# EAGLE design Craft (EAGLE 6.6.0)
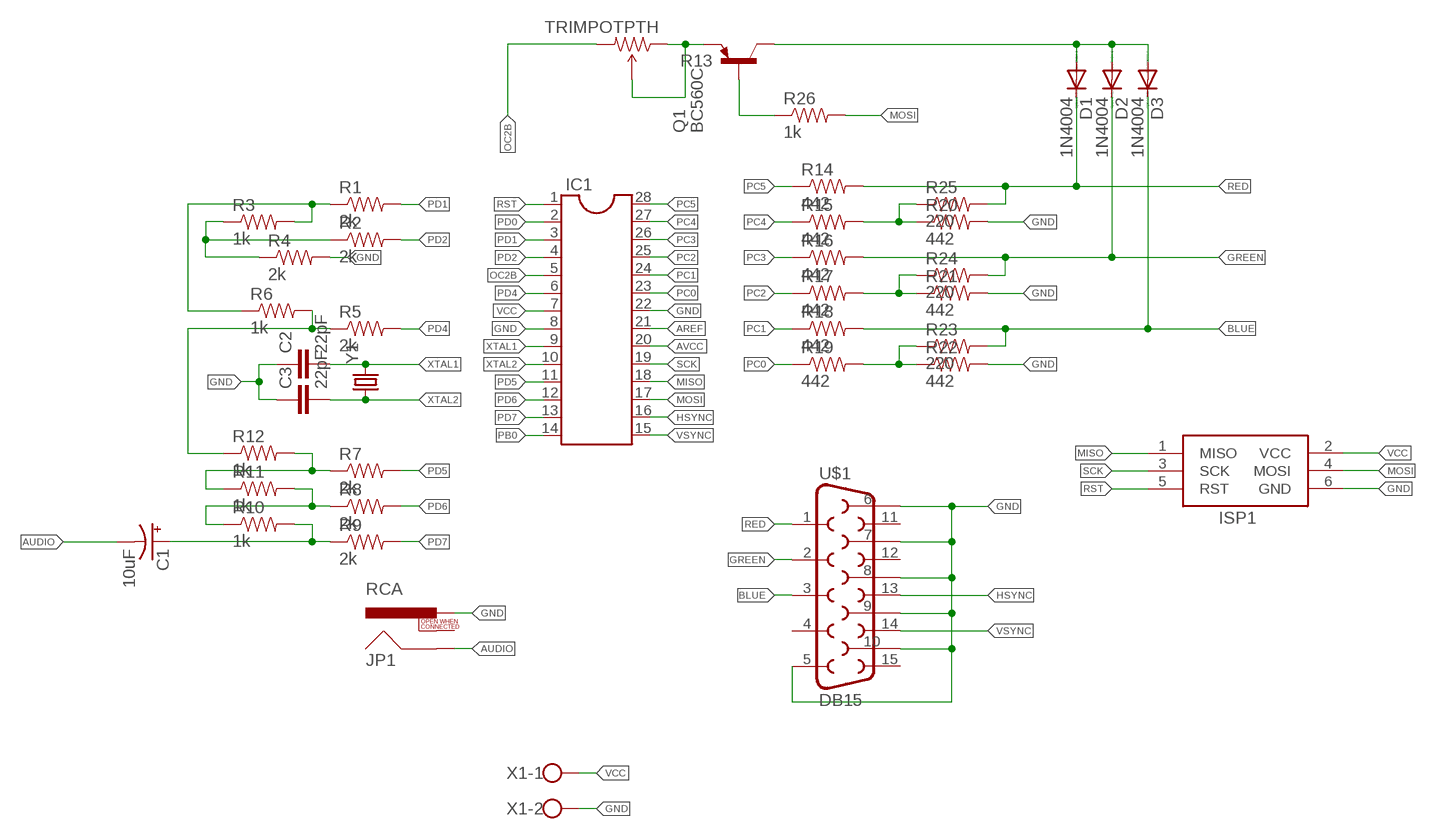
[diagram p0: schematic, sheet 1]

## Parts
C1  10uF  CAP_POLPTH1  [CPOL-RADIAL-100UF-25V]
C2  22pF  CAPEZ  [CAP-PTH-SMALLEZ]
C3  22pF  CAPEZ  [CAP-PTH-SMALLEZ]
D1  1N4004  [DO41-10]
D2  1N4004  [DO41-10]
D3  1N4004  [DO41-10]
IC1  DIL28-3  [DIL28-3]
ISP1  AVRISP-6  [AVRISP]
JP1  RCA  [RCA]
Q1  BC560C  [TO92-EBC]
R1  2k  RESISTORPTH-1/4W  [AXIAL-0.4]
R2  2k  RESISTORPTH-1/4W  [AXIAL-0.4]
R3  1k  RESISTORPTH-1/4W  [AXIAL-0.4]
R4  2k  RESISTORPTH-1/4W  [AXIAL-0.4]
R5  2k  RESISTORPTH-1/4W  [AXIAL-0.4]
R6  1k  RESISTORPTH-1/4W  [AXIAL-0.4]
R7  2k  RESISTORPTH-1/4W  [AXIAL-0.4]
R8  2k  RESISTORPTH-1/4W  [AXIAL-0.4]
R9  2k  RESISTORPTH-1/4W  [AXIAL-0.4]
R10  1k  RESISTORPTH-1/4W  [AXIAL-0.4]
R11  1k  RESISTORPTH-1/4W  [AXIAL-0.4]
R12  1k  RESISTORPTH-1/4W  [AXIAL-0.4]
R13  TRIMPOTPTH  [TRIM_POT_PTH]
R14  442  RESISTORPTH-1/4W  [AXIAL-0.4]
R15  442  RESISTORPTH-1/4W  [AXIAL-0.4]
R16  442  RESISTORPTH-1/4W  [AXIAL-0.4]
R17  442  RESISTORPTH-1/4W  [AXIAL-0.4]
R18  442  RESISTORPTH-1/4W  [AXIAL-0.4]
R19  442  RESISTORPTH-1/4W  [AXIAL-0.4]
R20  442  RESISTORPTH-1/4W  [AXIAL-0.4]
R21  442  RESISTORPTH-1/4W  [AXIAL-0.4]
R22  442  RESISTORPTH-1/4W  [AXIAL-0.4]
R23  220  RESISTORPTH-1/4W  [AXIAL-0.4]
R24  220  RESISTORPTH-1/4W  [AXIAL-0.4]
R25  220  RESISTORPTH-1/4W  [AXIAL-0.4]
R26  1k  RESISTORPTH-1/4W  [AXIAL-0.4]
U$1  DB15  [DB15]
X1  W237-102  [W237-102]
Y1  CRYSTALHC49UV  [HC49U-V]

## Nets
AREF: IC1.21
AUDIO: C1.2(-) JP1.SHELL
AVCC: IC1.20
BLUE: D3.C R18.P$2 R23.P$2 U$1.3
GND: C2.1 C3.1 IC1.8 IC1.22 ISP1.6(GND) JP1.PIN R4.P$2 R20.P$2 R21.P$2 R22.P$2 U$1.5 U$1.6 U$1.7 U$1.8 U$1.9 U$1.10 X1.2
GREEN: D2.C R16.P$2 R24.P$2 U$1.2
HSYNC: IC1.16 U$1.13
MISO: IC1.18 ISP1.1(MISO)
MOSI: IC1.17 ISP1.4(MOSI) R26.P$2
N$1: Q1.E R13.1(CCW) R13.2(WIPER)
N$2: D1.A D2.A D3.A Q1.C
N$3: Q1.B R26.P$1
N$4: R1.P$1 R3.P$2 R6.P$1
N$5: R5.P$1 R6.P$2 R12.P$1
N$6: R2.P$1 R3.P$1 R4.P$1
N$10: C1.1(+) R9.P$1 R10.P$2
N$11: R8.P$1 R10.P$1 R11.P$2
N$13: R7.P$1 R11.P$1 R12.P$2
N$16: R15.P$2 R20.P$1 R25.P$1
N$17: R17.P$2 R21.P$1 R24.P$1
N$18: R19.P$2 R22.P$1 R23.P$1
OC2B: IC1.5 R13.3(CW)
PB0: IC1.14
PC0: IC1.23 R19.P$1
PC1: IC1.24 R18.P$1
PC2: IC1.25 R17.P$1
PC3: IC1.26 R16.P$1
PC4: IC1.27 R15.P$1
PC5: IC1.28 R14.P$1
PD0: IC1.2
PD1: IC1.3 R1.P$2
PD2: IC1.4 R2.P$2
PD4: IC1.6 R5.P$2
PD5: IC1.11 R7.P$2
PD6: IC1.12 R8.P$2
PD7: IC1.13 R9.P$2
RED: D1.C R14.P$2 R25.P$2 U$1.1
RST: IC1.1 ISP1.5(RST)
SCK: IC1.19 ISP1.3(SCK)
VCC: IC1.7 ISP1.2(VCC) X1.1
VSYNC: IC1.15 U$1.14
XTAL1: C2.2 IC1.9 Y1.2
XTAL2: C3.2 IC1.10 Y1.1
Unconnected: JP1.SWITCH U$1.4 U$1.11 U$1.12 U$1.15

## Library data of the parts
C1 = SparkFun-Capacitors:CAP_POL: Capacitor Polarized These are standard SMD and PTH capacitors. Normally 10uF, 47uF, and 100uF in electrolytic and tantalum varieties. Always verify the external diameter of the through hole cap, it varies with capacity, voltage, and manufacturer. The EIA devices should be standard.
C2 C3 = SparkFun-Capacitors:CAP: Capacitor Standard 0603 ceramic capacitor, and 0.1" leaded capacitor.
D1-D3 = diode:1N4004: DIODE general purpose rectifier, 1 A
IC1 = ic-package:DIL28: Dual In Line
ISP1 = adafruit:AVRISP: AVR ISP HEADER Standard 6 pin header for AVR programming
JP1 = SparkFun-Connectors:RCA
Q1 = transistor-pnp:BC560*: PNP Transistror
R1-R12 R14-R26 = SparkFun-Resistors:RESISTOR: Resistor Basic schematic elements and footprints for 0603, 1206, and PTH resistors.
R13 = SparkFun-Electromechanical:TRIMPOT: Various small potentiometers for "set-and-forget" applications
U$1 = SparkFun-Connectors:DB15: DB15 / VGA right angle through-hole female connector.
X1 = con-wago-500:W237-102: WAGO SCREW CLAMP; MPN: 237-102; OC_FARNELL: unknown; OC_NEWARK: 70K9898
Y1 = SparkFun-FreqCtrl:CRYSTAL: Various standard crystals. Proven footprints. Spark Fun Electronics SKU : COM-00534

## Board
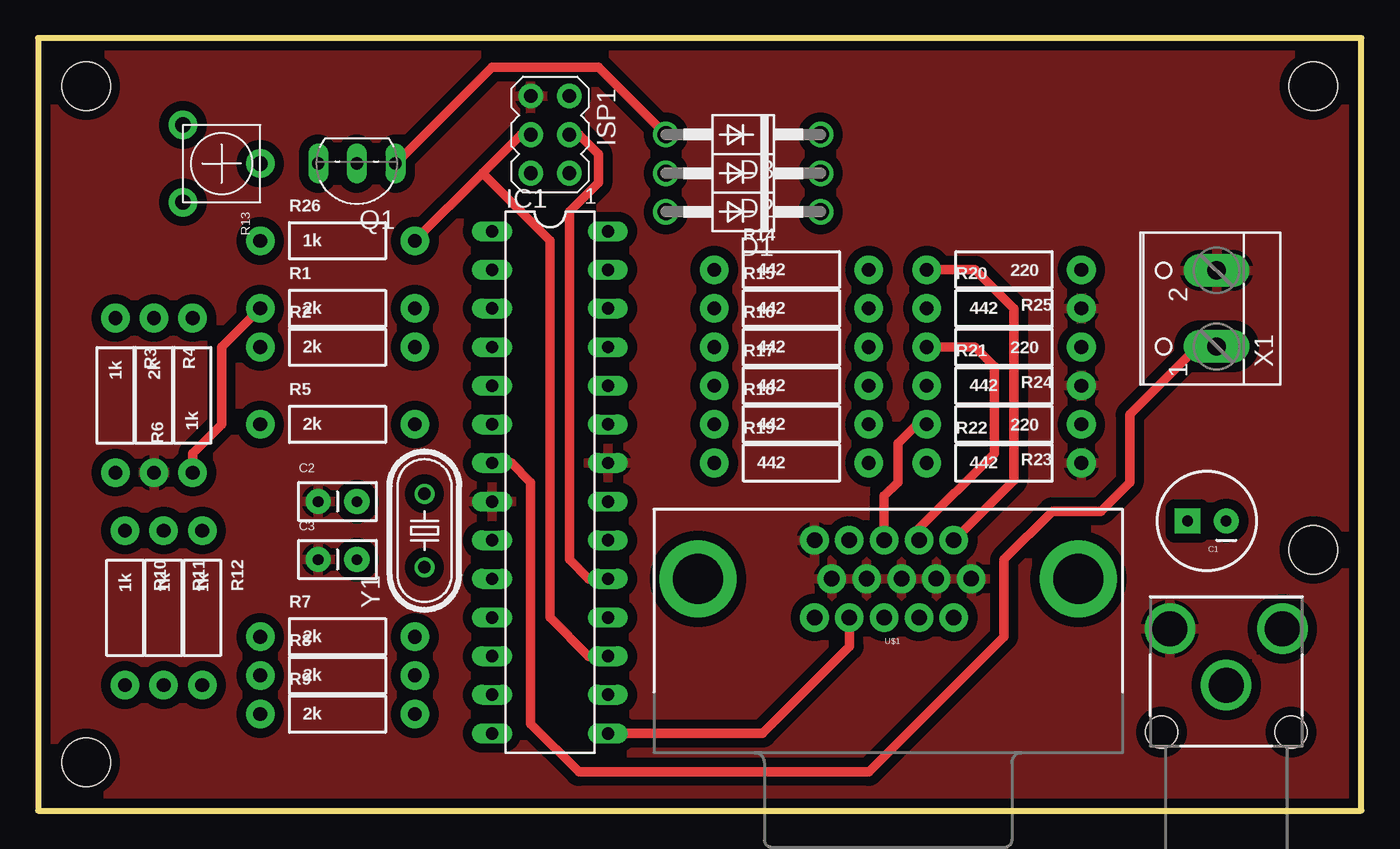
[diagram p1: board, top side]
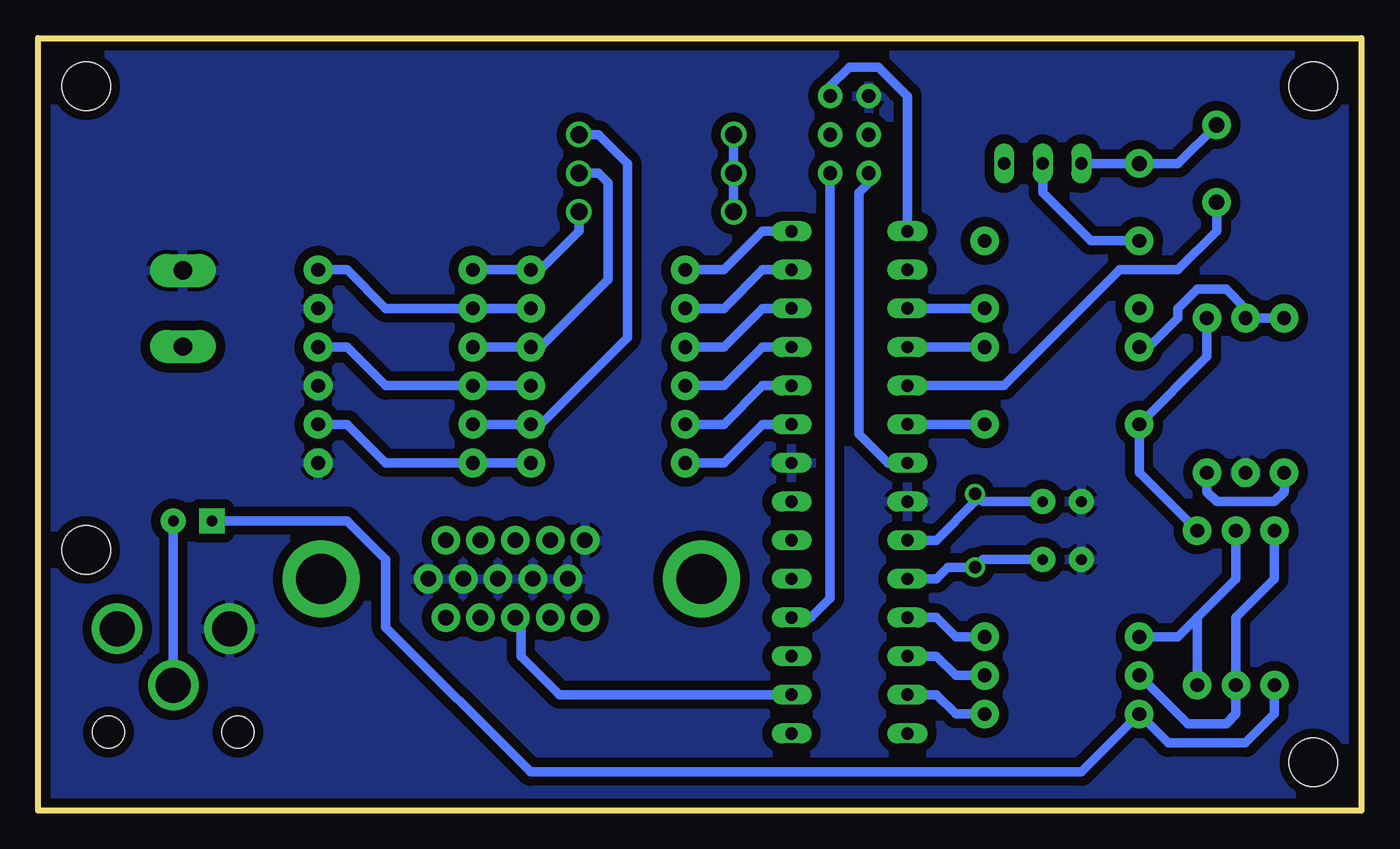
[diagram p2: board, bottom side, seen from below]

Size 87 x 50.8 mm. Coordinates in mm from the lower left corner, seen from the top.
Outline: 0,0 87,0 87,50.8 0,50.8 0,0
Copper layers (1*16): Top 0.035mm / dielectric 1.5mm / Bottom 0.035mm
Design rules "default *": minimum track width 10mil, minimum drill 24mil, track to track 8mil, track to pad 8mil, pad to pad 8mil, via to via 8mil, smd to smd 8mil, copper to edge 10mil, drill to drill 8mil, minimum pad ring 10mil, minimum via ring 8mil, stop-mask expansion 4mil, vias tented up to drill 0mil, thermal gap 10mil
Holes 3.2 mm at 3.17,47.62 3.17,3.17 83.82,47.62 83.82,17.14

### Footprints (pad centres in the part's own frame; a part is rotated, then mirrored left to right if it is on the bottom)
CPOL-RADIAL-100UF-25V = drill 0.7 pad 1.651 square: 1 1.27,0 | drill 0.7 pad 1.651: 2 -1.27,0
CAP-PTH-SMALLEZ = drill 0.7 pad 1.651: 1 0,0; 2 2.54,0
DO41-10 = drill 1.118: A 5.08,0; C -5.08,0
DIL28-3 = drill 0.813 long: 1 -16.51,-3.81; 2 -13.97,-3.81; 3 -11.43,-3.81; 4 -8.89,-3.81; 5 -6.35,-3.81; 6 -3.81,-3.81; 7 -1.27,-3.81; 8 1.27,-3.81; 9 3.81,-3.81; 10 6.35,-3.81; 11 8.89,-3.81; 12 11.43,-3.81; 13 13.97,-3.81; 14 16.51,-3.81; 15 16.51,3.81; 16 13.97,3.81; 17 11.43,3.81; 18 8.89,3.81; 19 6.35,3.81; 20 3.81,3.81; 21 1.27,3.81; 22 -1.27,3.81; 23 -3.81,3.81; 24 -6.35,3.81; 25 -8.89,3.81; 26 -11.43,3.81; 27 -13.97,3.81; 28 -16.51,3.81
AVRISP = drill 0.9 pad 1.626: 1 -1.27,2.54; 2 1.27,2.54; 3 -1.27,0; 4 1.27,0; 5 -1.27,-2.54; 6 1.27,-2.54
RCA = drill 2.3: PIN 3.7,3.7; SHELL 0,0; SWITCH 3.7,-3.7 | hole 2.1: -3.1,4.25; -3.1,-4.25
TO92-EBC = drill 0.813 long: B 0,-1.27; C -2.54,-1.27; E 2.54,-1.27
AXIAL-0.4 = drill 0.9 pad 1.88: P$1 -5.08,0; P$2 5.08,0
TRIM_POT_PTH = drill 1 pad 1.88: 1 -2.54,-2.54; 2 0,2.54; 3 2.54,-2.54
DB15 = drill 1.016 pad 1.88: 1 -4.32,-7.62; 2 -2.03,-7.62; 3 0.26,-7.62; 4 2.55,-7.62; 5 4.84,-7.62; 6 -5.46,-5.08; 7 -3.17,-5.08; 8 -0.88,-5.08; 9 1.41,-5.08; 10 3.7,-5.08; 11 -4.32,-2.54; 12 -2.03,-2.54; 13 0.26,-2.54; 14 2.55,-2.54; 15 4.84,-2.54 | drill 3.302 pad 5.08: G1 -12.5,-5.08; G2 12.5,-5.08
W237-102 = drill 1.194 pad 2.184 long: 1 -2.5,-1.27; 2 2.5,-1.27
HC49U-V = drill 0.813: 1 -2.413,0; 2 2.413,0

### Placement (x,y rotation side)
C1  76.83,19.05 180 top
C2  18.41,20.32 0 top
C3  18.41,16.51 0 top
D1  46.35,39.37 180 top
D2  46.35,41.91 180 top
D3  46.35,44.45 180 top
IC1  33.66,21.59 270 top
ISP1  33.66,44.45 180 top
JP1  78.11,8.26 90 top
Q1  20.95,41.27 180 top
R1  19.68,33.02 0 top
R2  19.68,30.48 0 top
R3  5.08,27.3 270 top
R4  7.62,27.3 270 top
R5  19.68,25.4 0 top
R6  10.16,27.3 90 top
R7  19.68,11.43 0 top
R8  19.68,8.89 0 top
R9  19.68,6.35 0 top
R10  5.71,13.34 270 top
R11  8.26,13.34 270 top
R12  10.79,13.34 270 top
R13  12.06,42.55 270 top
R14  49.53,35.56 0 top
R15  49.53,33.02 0 top
R16  49.53,30.48 0 top
R17  49.53,27.94 0 top
R18  49.53,25.4 0 top
R19  49.53,22.86 0 top
R20  63.5,33.02 0 top
R21  63.5,27.94 0 top
R22  63.5,22.86 0 top
R23  63.5,25.4 180 top
R24  63.5,30.48 180 top
R25  63.5,35.56 180 top
R26  19.68,37.47 0 top
U$1  55.88,10.16 180 top
X1  76.2,33.02 90 top
Y1  25.4,18.41 90 top

### Tracks (layer width: path | path; a pad name or v marks a point on that pad's centre or on a via)
AUDIO
  Bottom 0.61: C1.2 JP1.SHELL
BLUE
  Top 0.61: U$1.3 55.62,20.7 56.52,21.59 56.52,24.13 57.78,25.4 R23.P$2
  Bottom 0.61: R23.P$2 R18.P$2 53.98,25.4 48.26,31.11 48.26,42.55 50.16,44.45 D3.C
GND
  pour Top (isolate 0.61): 0,50.8 87,50.8 87,0 0,0
  pour Bottom (isolate 0.61): 0,50.8 87,50.8 87,0 0,0
GREEN
  Top 0.61: R24.P$2 61.59,30.48 62.87,29.21 62.87,23.5 57.78,18.41 57.78,17.91 U$1.2
  Bottom 0.61: R24.P$2 R16.P$2 53.98,30.48 49.53,34.92 49.53,41.27 50.16,41.91 D2.C
HSYNC
  Bottom 0.61: IC1.16 52.7,7.62 55.24,10.16 55.24,12.32 U$1.13
MISO
  Bottom 0.61: ISP1.1 34.92,13.97 36.2,12.7 IC1.18
MOSI
  Top 0.61: R26.P$2 29.21,41.91 | 29.21,41.91 31.75,44.45 ISP1.4 | IC1.17 36.2,10.16 33.66,12.7 33.66,37.47 29.21,41.91
N$1
  Bottom 0.61: R13.1 12.06,42.55 R13.2 Q1.E
N$2
  Top 0.61: Q1.C 29.84,48.9 36.83,48.9 D3.A
  Bottom 0.61: D3.A D2.A D1.A
N$3
  Bottom 0.61: R26.P$1 17.78,37.47 20.95,40.64 Q1.B
N$4
  Top 0.61: R6.P$1 10.16,23.5 12.06,25.4 12.06,30.48 R1.P$1
  Bottom 0.61: R3.P$2 5.08,20.95 5.71,20.32 9.53,20.32 10.16,20.95 R6.P$1
N$5
  Bottom 0.61: R6.P$2 10.16,29.84 R5.P$1 14.61,22.23 R12.P$1
N$6
  Bottom 0.61: R3.P$1 R4.P$1 7.62,33.02 8.89,34.29 10.79,34.29 12.06,33.02 12.06,32.38 13.97,30.48 R2.P$1
N$10
  Bottom 0.61: R10.P$2 5.71,6.35 7.62,4.45 12.7,4.45 R9.P$1 18.41,2.54 54.61,2.54 64.14,12.06 64.14,16.51 66.67,19.05 C1.1
N$11
  Bottom 0.61: R10.P$1 5.71,15.24 8.26,12.7 R11.P$2 8.26,6.35 8.89,5.71 11.43,5.71 R8.P$1
N$13
  Bottom 0.61: R11.P$1 8.26,15.24 10.79,12.7 | 10.79,12.7 R12.P$2 | R7.P$1 12.06,11.43 10.79,12.7
N$16
  Bottom 0.61: R15.P$2 R20.P$1 64.14,33.02 66.67,35.56 R25.P$1
N$17
  Bottom 0.61: R17.P$2 R21.P$1 64.14,27.94 66.67,30.48 R24.P$1
N$18
  Bottom 0.61: R19.P$2 R22.P$1 64.14,22.86 66.67,25.4 R23.P$1
OC2B
  Bottom 0.61: R13.3 9.53,38.1 12.06,35.56 15.88,35.56 23.5,27.94 IC1.5
PC0
  Bottom 0.61: IC1.23 39.37,25.4 41.91,22.86 R19.P$1
PC1
  Bottom 0.61: IC1.24 39.37,27.94 41.91,25.4 R18.P$1
PC2
  Bottom 0.61: IC1.25 39.37,30.48 41.91,27.94 R17.P$1
PC3
  Bottom 0.61: IC1.26 39.37,33.02 41.91,30.48 R16.P$1
PC4
  Bottom 0.61: IC1.27 39.37,35.56 41.91,33.02 R15.P$1
PC5
  Bottom 0.61: IC1.28 39.37,38.1 41.91,35.56 R14.P$1
PD1
  Bottom 0.61: R1.P$2 IC1.3
PD2
  Bottom 0.61: R2.P$2 IC1.4
PD4
  Bottom 0.61: R5.P$2 IC1.6
PD5
  Bottom 0.61: R7.P$2 26.67,11.43 27.94,12.7 IC1.11
PD6
  Bottom 0.61: R8.P$2 26.67,8.89 27.94,10.16 IC1.12
PD7
  Bottom 0.61: R9.P$2 26.67,6.35 27.94,7.62 IC1.13
RED
  Top 0.61: R25.P$2 61.59,35.56 64.14,33.02 64.14,21.71 U$1.1
  Bottom 0.61: R25.P$2 R14.P$2 53.98,35.56 51.44,38.1 D1.C
RST
  Bottom 0.61: ISP1.5 34.92,47.62 33.66,48.9 31.75,48.9 29.84,46.99 IC1.1
SCK
  Top 0.61: ISP1.3 35.56,44.45 36.83,43.18 36.83,41.27 34.92,39.37 34.92,16.51 36.2,15.24 IC1.19
VCC
  Top 0.61: X1.1 77.43,30.48 76.2,30.48 71.75,26.04 71.75,21.59 69.85,19.68 66.67,19.68 63.5,16.51 63.5,11.43 54.61,2.54 35.56,2.54 32.38,5.71 32.38,21.59 31.11,22.86 IC1.7
  Bottom 0.61: ISP1.2 32.38,41.27 33.02,40.64 33.02,24.77 31.11,22.86 IC1.7
VSYNC
  Top 0.61: IC1.15 47.62,5.08 53.34,10.79 U$1.14
XTAL1
  Bottom 0.61: IC1.9 27.94,17.78 25.4,20.32 Y1.2 24.89,20.32 C2.2
XTAL2
  Bottom 0.61: IC1.10 27.94,15.24 27.18,16 Y1.1 24.89,16.51 C3.2